# Altium schematic sheet Esquematico_Amplificador.SchDoc
size A4
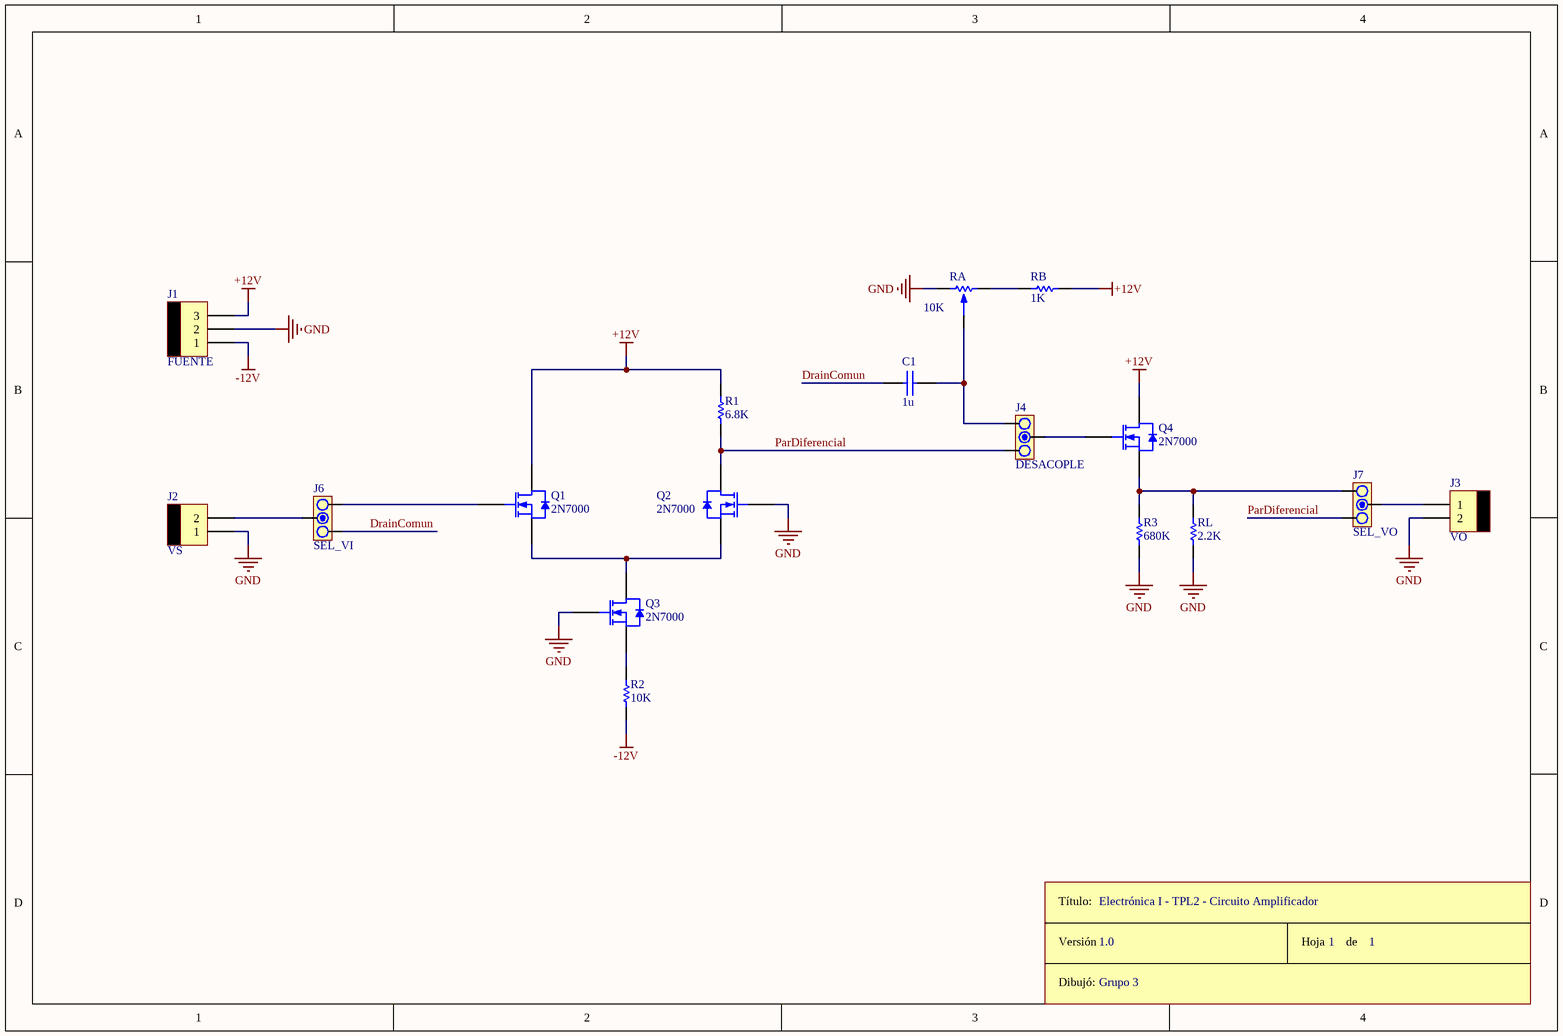
[diagram p0: Esquematico_Amplificador.SchDoc]

## Parts
C1  1u  [CAP200]
J1  FUENTE  [MOLEX3]
J2  VS  [MOLEX2]
J3  VO  [MOLEX2]
J4  DESACOPLE  [JUMPER3]
J6  SEL_VI  [JUMPER3]
J7  SEL_VO  [JUMPER3]
Q1  2N7000  [SOT54]
Q2  2N7000  [SOT54]
Q3  2N7000  [SOT54]
Q4  2N7000  [SOT54]
R1  6.8K  [RES300]
R2  10K  [RES300]
R3  680K  [RES300]
RA  10K  [PRESET V]
RB  1K  [RES300]
RL  2.2K  [RES300]
ROT1  Rótulo  (value not drawn)

## Nets
+12V: J1.3 Q1.1(D) Q4.1(D) R1.2 RB.1
-12V: J1.1 R2.1
GND: J1.2 J2.1 J3.2 Q2.2(G) Q3.2(G) R3.1 RA.3 RL.1
DrainComun: C1.1 J6.3
ParDiferencial: J4.1 J7.1 Q2.1(D) R1.1
NetC1_2: C1.2 J4.3 RA.2
NetJ2_2: J2.2 J6.2
NetJ3_1: J3.1 J7.2
NetJ4_2: J4.2 Q4.2(G)
NetJ6_1: J6.1 Q1.2(G)
NetJ7_3: J7.3 Q4.3(S) R3.2 RL.2
NetQ1_3: Q1.3(S) Q2.3(S) Q3.1(D)
NetQ3_3: Q3.3(S) R2.2
NetRA_1: RA.1 RB.2

## Notes on the sheet
- Electrónica I - TPL2 - Circuito Amplificador
- 1.0
- Grupo 3
- 1
- (in symbol Rótulo) Título:; Versión; Hoja       de; Dibujó:

## Library data of the parts
C1 = CAP
J1 = MOLEX3
J2 J3 = MOLEX2
J4 J6 J7 = JUMPER3
Q1-Q4 = 2N7000: N-channel Enhancement Mode Field-effect Transistor; Published: 17-Sep-2003; LatestRevisionDate: 12-Dec-2006; LatestRevisionNote: Footprint pad sequence fixed.; DatasheetVersion: 19-May-2000; PackageVersion: Feb-1997; PackageReference: SOT54; Publisher: Altium Limited; PackageDescription: Plastic Single-Ended Leaded (through hole) package; 3 Leads (TO-92); Code_JEITA: SC-43; Code_JEDEC: TO-92; ComponentLink1Description: Manufacturer Link; ComponentLink1URL: http://www.semiconductors.philips.com/; ComponentLink2Description: Datasheet; ComponentLink2URL: http://www.semiconductors.philips.com/acrobat/datasheets/2N7000-03.pdf
R1-R3 RB RL = RES
RA = PRESET